# EAGLE design Joystick-Breakout-v12 (EAGLE 5.11)
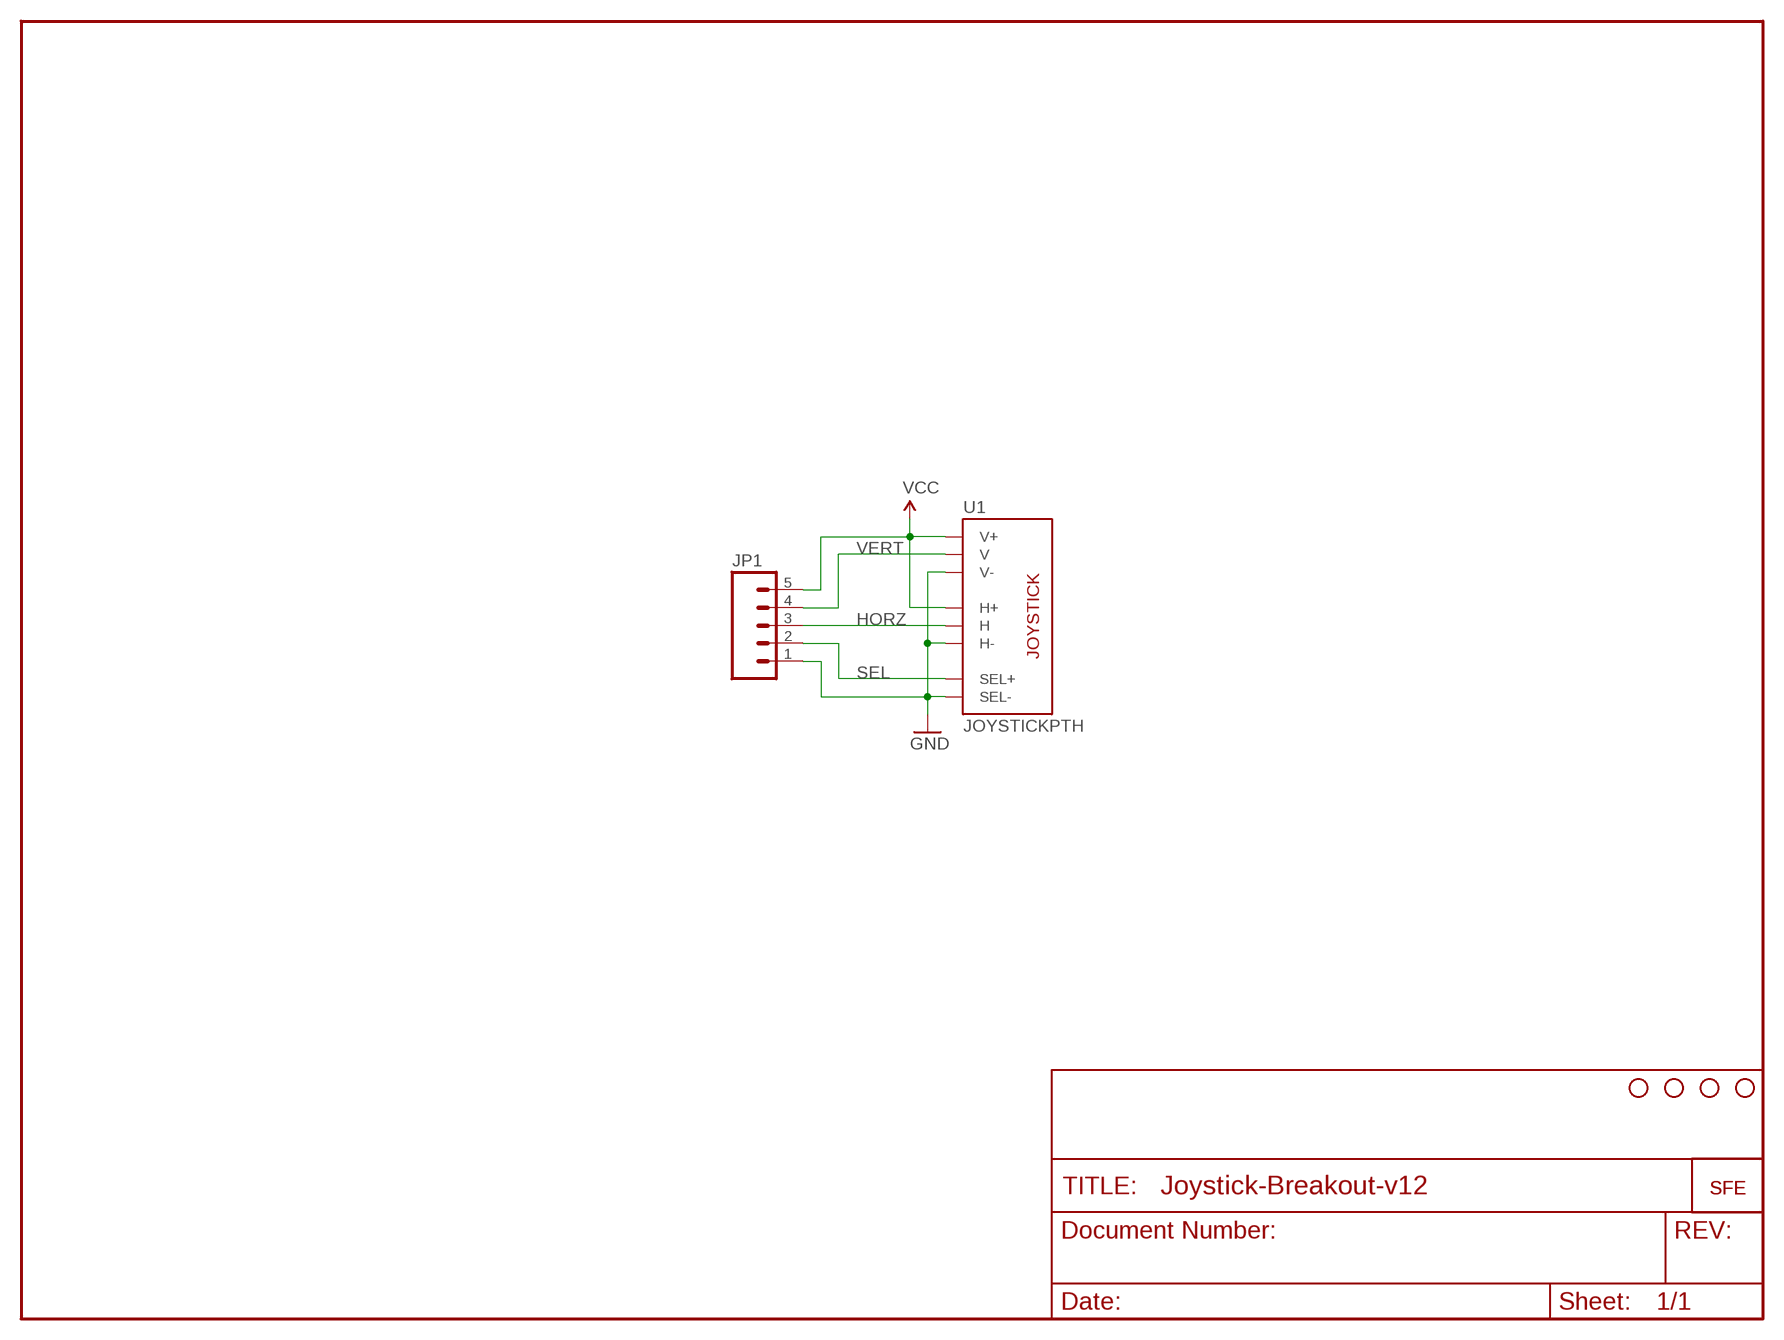
[diagram p0: schematic, sheet 1]

## Parts
JP1  M05PTH  [1X05]
U1  JOYSTICKPTH  [JOYSTICK]
U$1  LOGO-SFENEW  [SFE-NEW-WEBLOGO]
U$2  LOGO-SFESK  [SFE-LOGO-FLAME]
U$3  STAND-OFF  [STAND-OFF]
U$4  STAND-OFF  [STAND-OFF]
U$5  STAND-OFF  [STAND-OFF]
U$6  STAND-OFF  [STAND-OFF]

## Nets
GND: JP1.1 U1.B2A(SEL-) U1.H3(H-) U1.V3(V-)
HORZ: JP1.3 U1.H2(H)
SEL: JP1.2 U1.B1A(SEL+)
VCC: JP1.5 U1.H1(H+) U1.V1(V+)
VERT: JP1.4 U1.V2(V)

## Library data of the parts
JP1 = SparkFun:M05: Header 5 Standard 5-pin 0.1" header. Use with straight break away headers (SKU : PRT-00116), right angle break away headers (PRT-00553), swiss pins (PRT-00743), machine pins (PRT-00117), and female headers (PRT-00115). Molex polarized connector foot print use with SKU : PRT-08230 with associated crimp pins and housings.
U1 = SparkFun:JOYSTICK: Thumb Joystick Joystick commonly found in PS2 controllers. Two pots and a select switch. Footprint proven. Spark Fun Electronics SKU : COM-09032
U$1 U$2 = SparkFun:LOGO-SFE: Spark Fun Electronics PCB Logo This is the standard Spark Fun Electronics PCB logo.
U$3-U$6 = SparkFun:STAND-OFF: Stand Off This is the mechanical footprint for a #4 phillips button head screw. Use the keepout ring to avoid running the screw head into surrounding components. SKU : PRT-00447

## Board
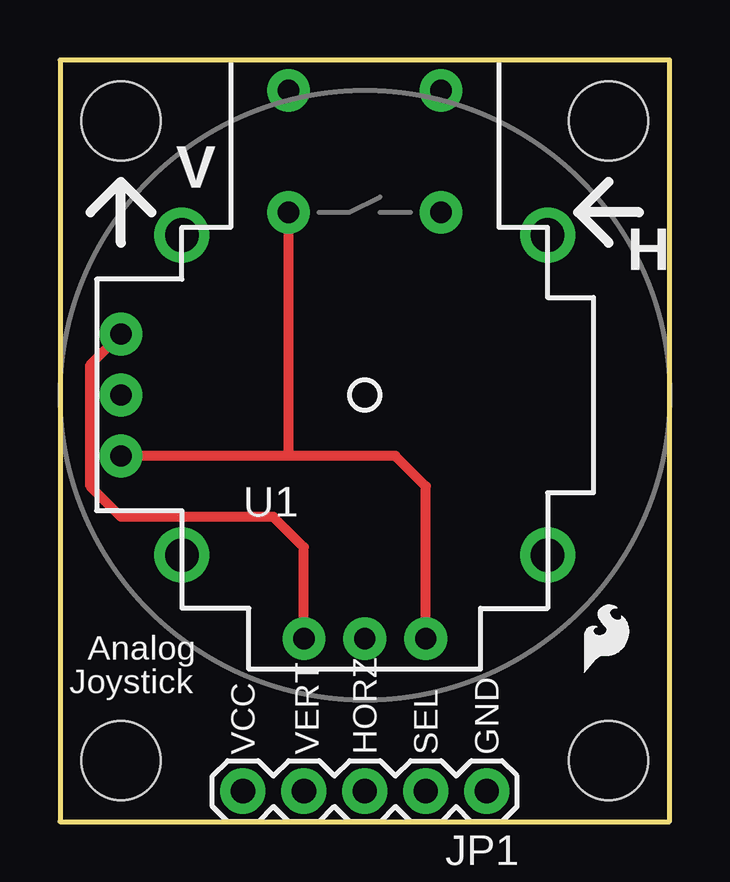
[diagram p1: board, top side]
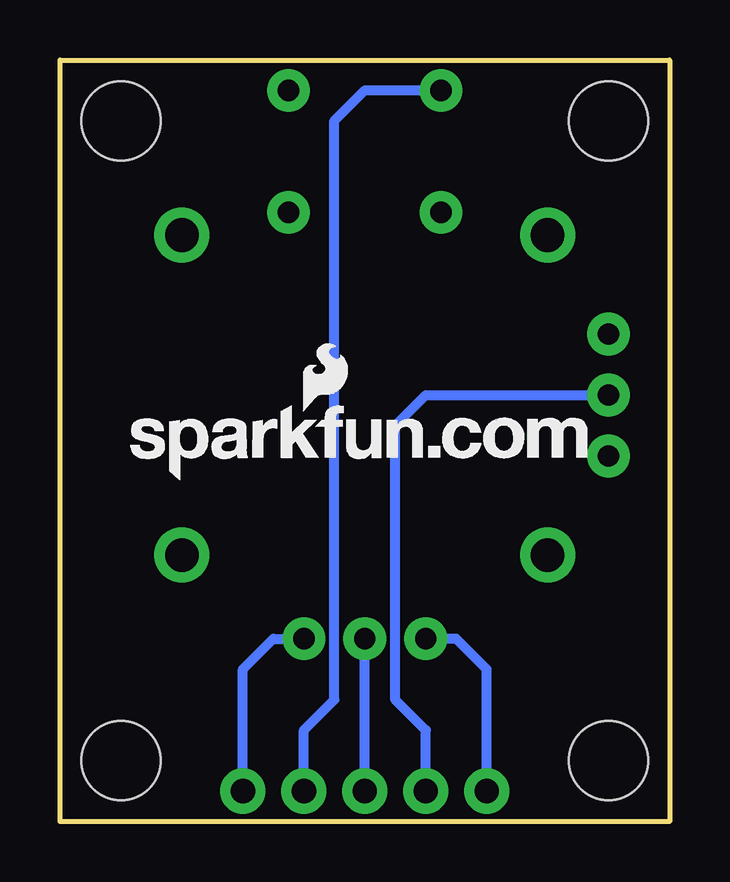
[diagram p2: board, bottom side, seen from below]

Size 25.4 x 31.75 mm. Coordinates in mm from the lower left corner, seen from the top.
Outline: 0,0 25.4,0 25.4,31.75 0,31.75 0,0
Copper layers (1*16): Top 0.035mm / dielectric 1.5mm / Bottom 0.035mm
Design rules "SparkFun": minimum track width 8mil, minimum drill 20mil, track to track 8mil, track to pad 8mil, pad to pad 8mil, via to via 8mil, smd to smd 8mil, copper to edge 10mil, drill to drill 8mil, minimum pad ring 12mil, minimum via ring 10mil, stop-mask expansion 4mil, vias tented up to drill 25mil, thermal gap 10mil

### Footprints (pad centres in the part's own frame; a part is rotated, then mirrored left to right if it is on the bottom)
1X05 = drill 1.016 pad 1.88 round: 1 0,0; 2 2.54,0; 3 5.08,0; 4 7.62,0; 5 10.16,0
JOYSTICK = drill 0.9 pad 1.778 round: B1A -3.175,12.7; B1B 3.175,12.7; B2A -3.175,7.62; B2B 3.175,7.62 | drill 0.889 pad 1.778 round: H1 -2.54,-10.16; H2 0,-10.16; H3 2.54,-10.16; V1 -10.16,2.54; V2 -10.16,0; V3 -10.16,-2.54 | drill 1.397 pad 2.286 round: MOUNT1 -7.62,6.668; MOUNT2 -7.62,-6.668; MOUNT3 7.62,-6.668; MOUNT4 7.62,6.668
STAND-OFF = hole 3.302: 0,0

### Placement (x,y rotation side)
JP1  17.78,1.27 180 top
U1  12.7,17.78 0 top
U$1  22.48,14.22 0 bottom
U$2  21.84,6.22 0 top
U$3  2.54,2.54 0 top
U$4  22.86,2.54 0 top
U$5  2.54,29.21 0 top
U$6  22.86,29.21 0 top

### Tracks (layer width: path | path; a pad name or v marks a point on that pad's centre or on a via)
GND
  Top 0.406: 9.53,15.24 13.97,15.24 15.24,13.97 U1.H3 | 9.53,15.24 U1.V3 | 9.53,15.24 U1.B2A
  Bottom 0.406: U1.H3 16.51,7.62 17.78,6.35 JP1.1
HORZ
  Bottom 0.406: JP1.3 U1.H2
SEL
  Bottom 0.406: JP1.2 15.24,3.81 13.97,5.08 13.97,29.21 12.7,30.48 U1.B1A
VCC
  Top 0.406: U1.V1 1.27,19.05 1.27,13.97 2.54,12.7 8.89,12.7 10.16,11.43 U1.H1
  Bottom 0.406: U1.H1 8.89,7.62 7.62,6.35 JP1.5
VERT
  Bottom 0.406: JP1.4 10.16,3.81 11.43,5.08 11.43,16.51 10.16,17.78 U1.V2

### Text on the board
tPlace: V | H | Analog | Joystick | VCC | VERT | HORZ | SEL | GND